# EAGLE design NICBP (EAGLE 8.1.0)
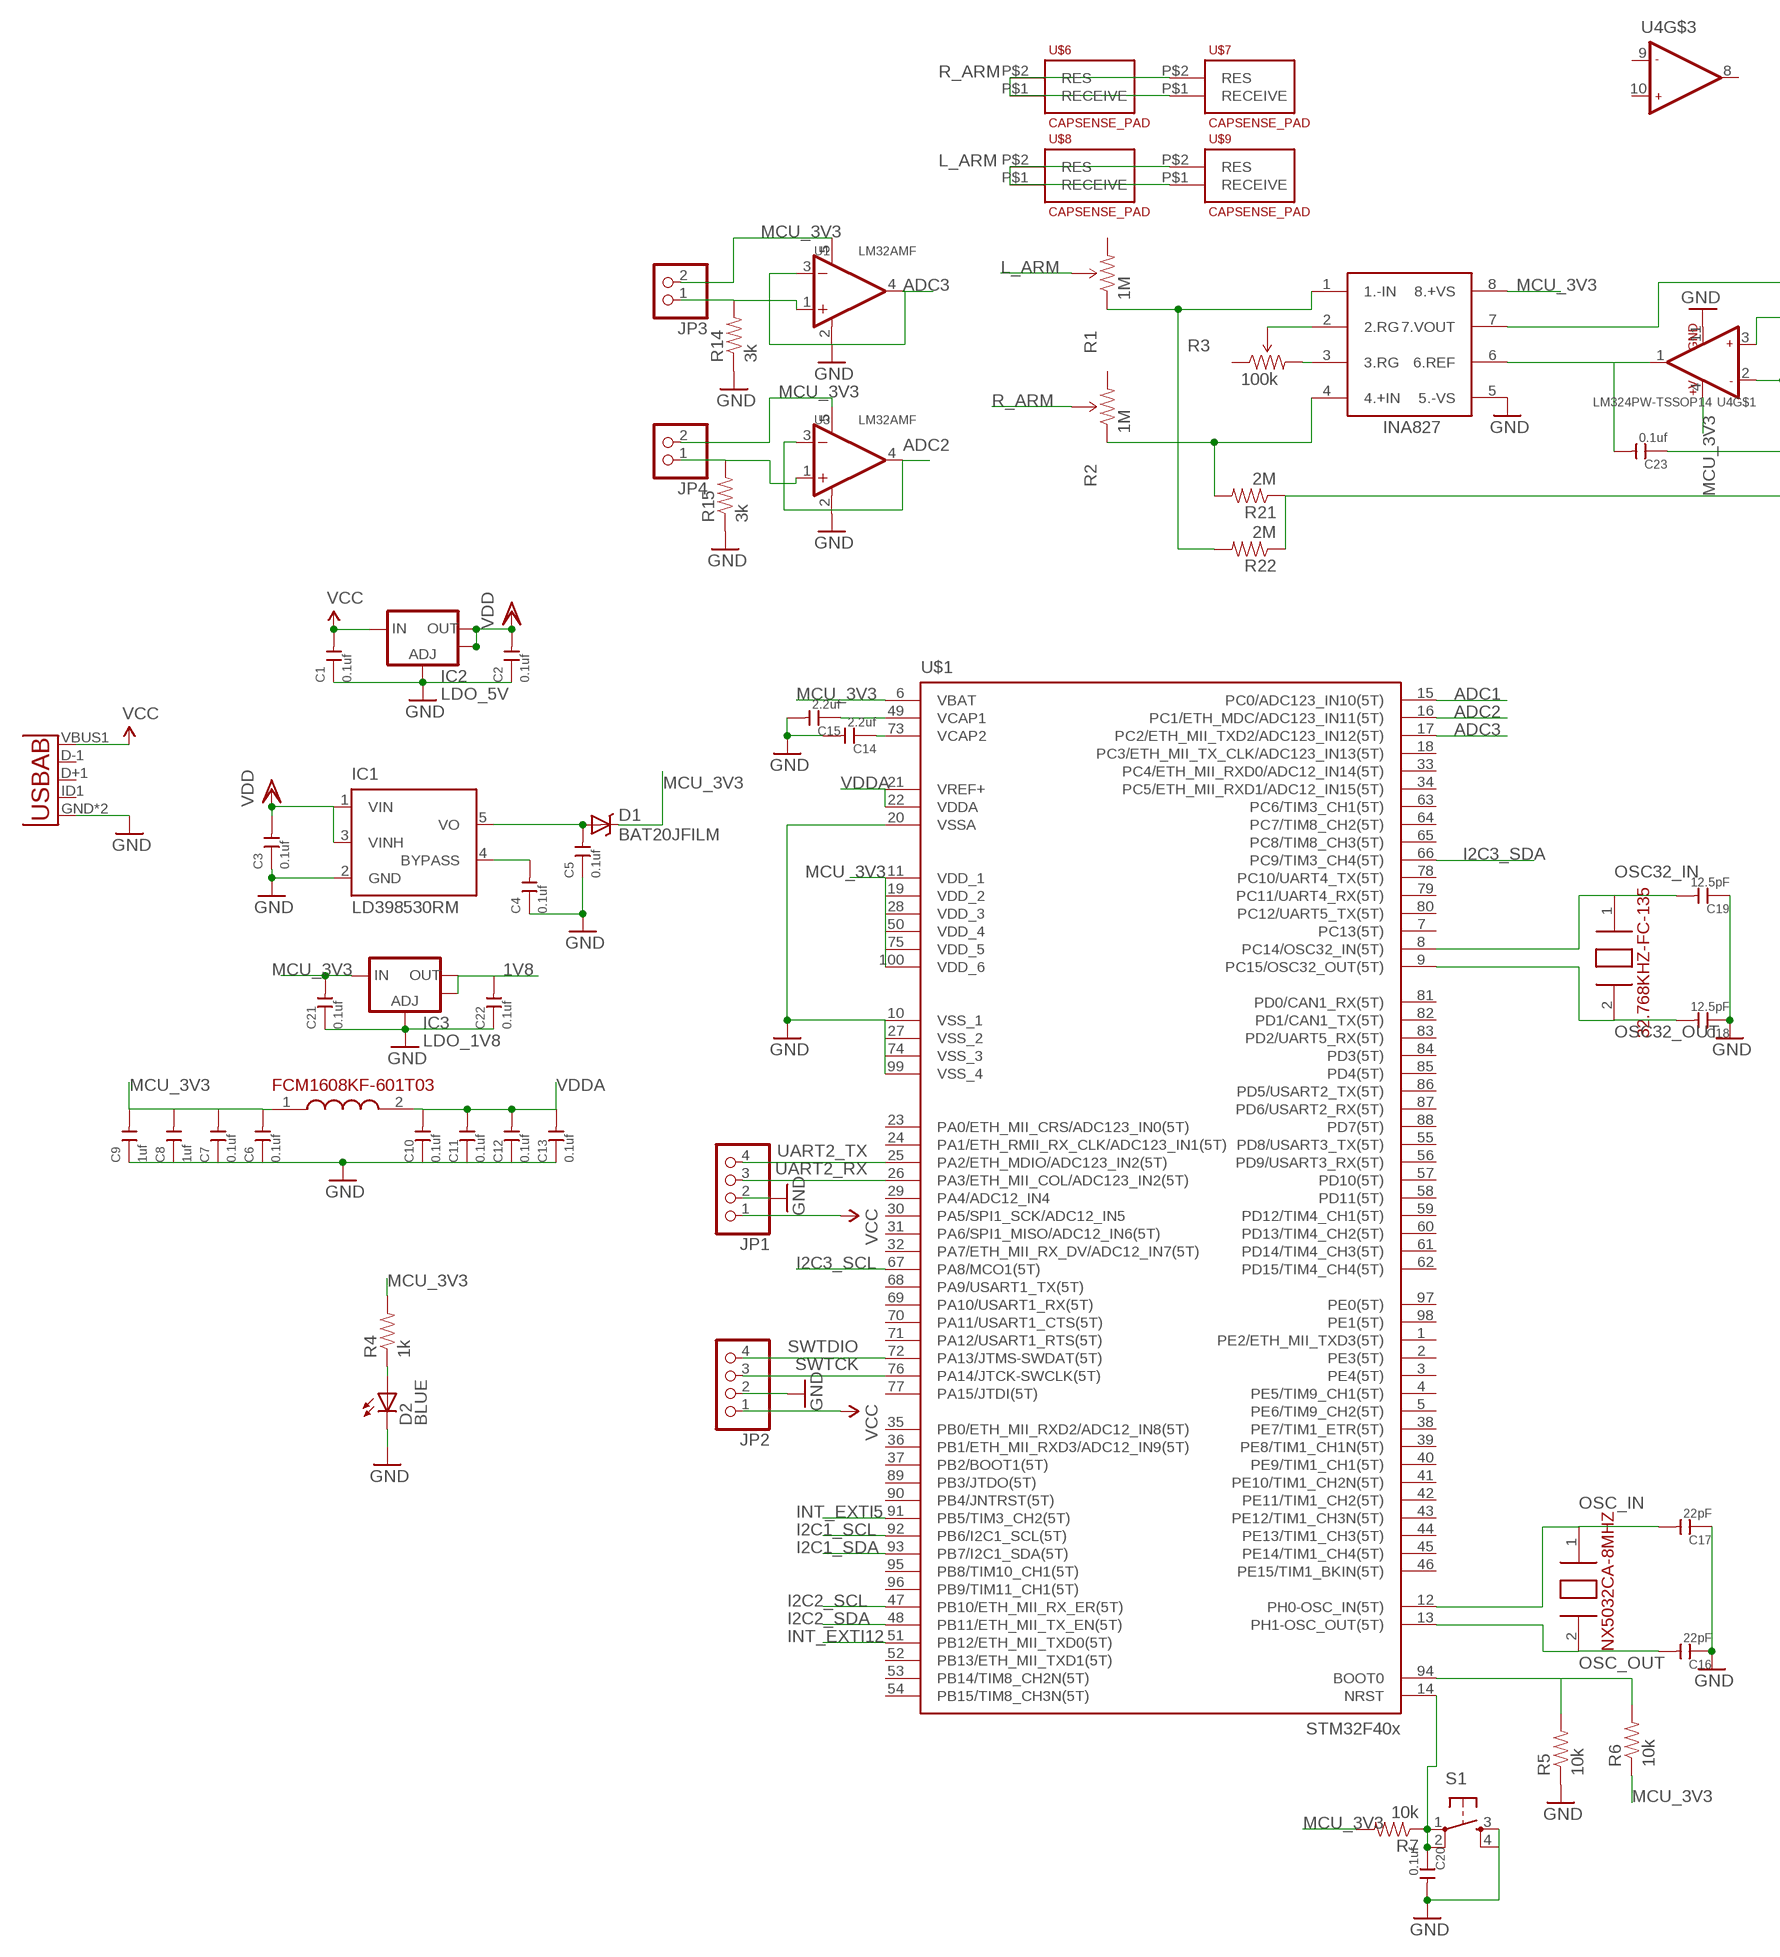
[diagram p0: schematic, sheet 1, part 1 of 2]
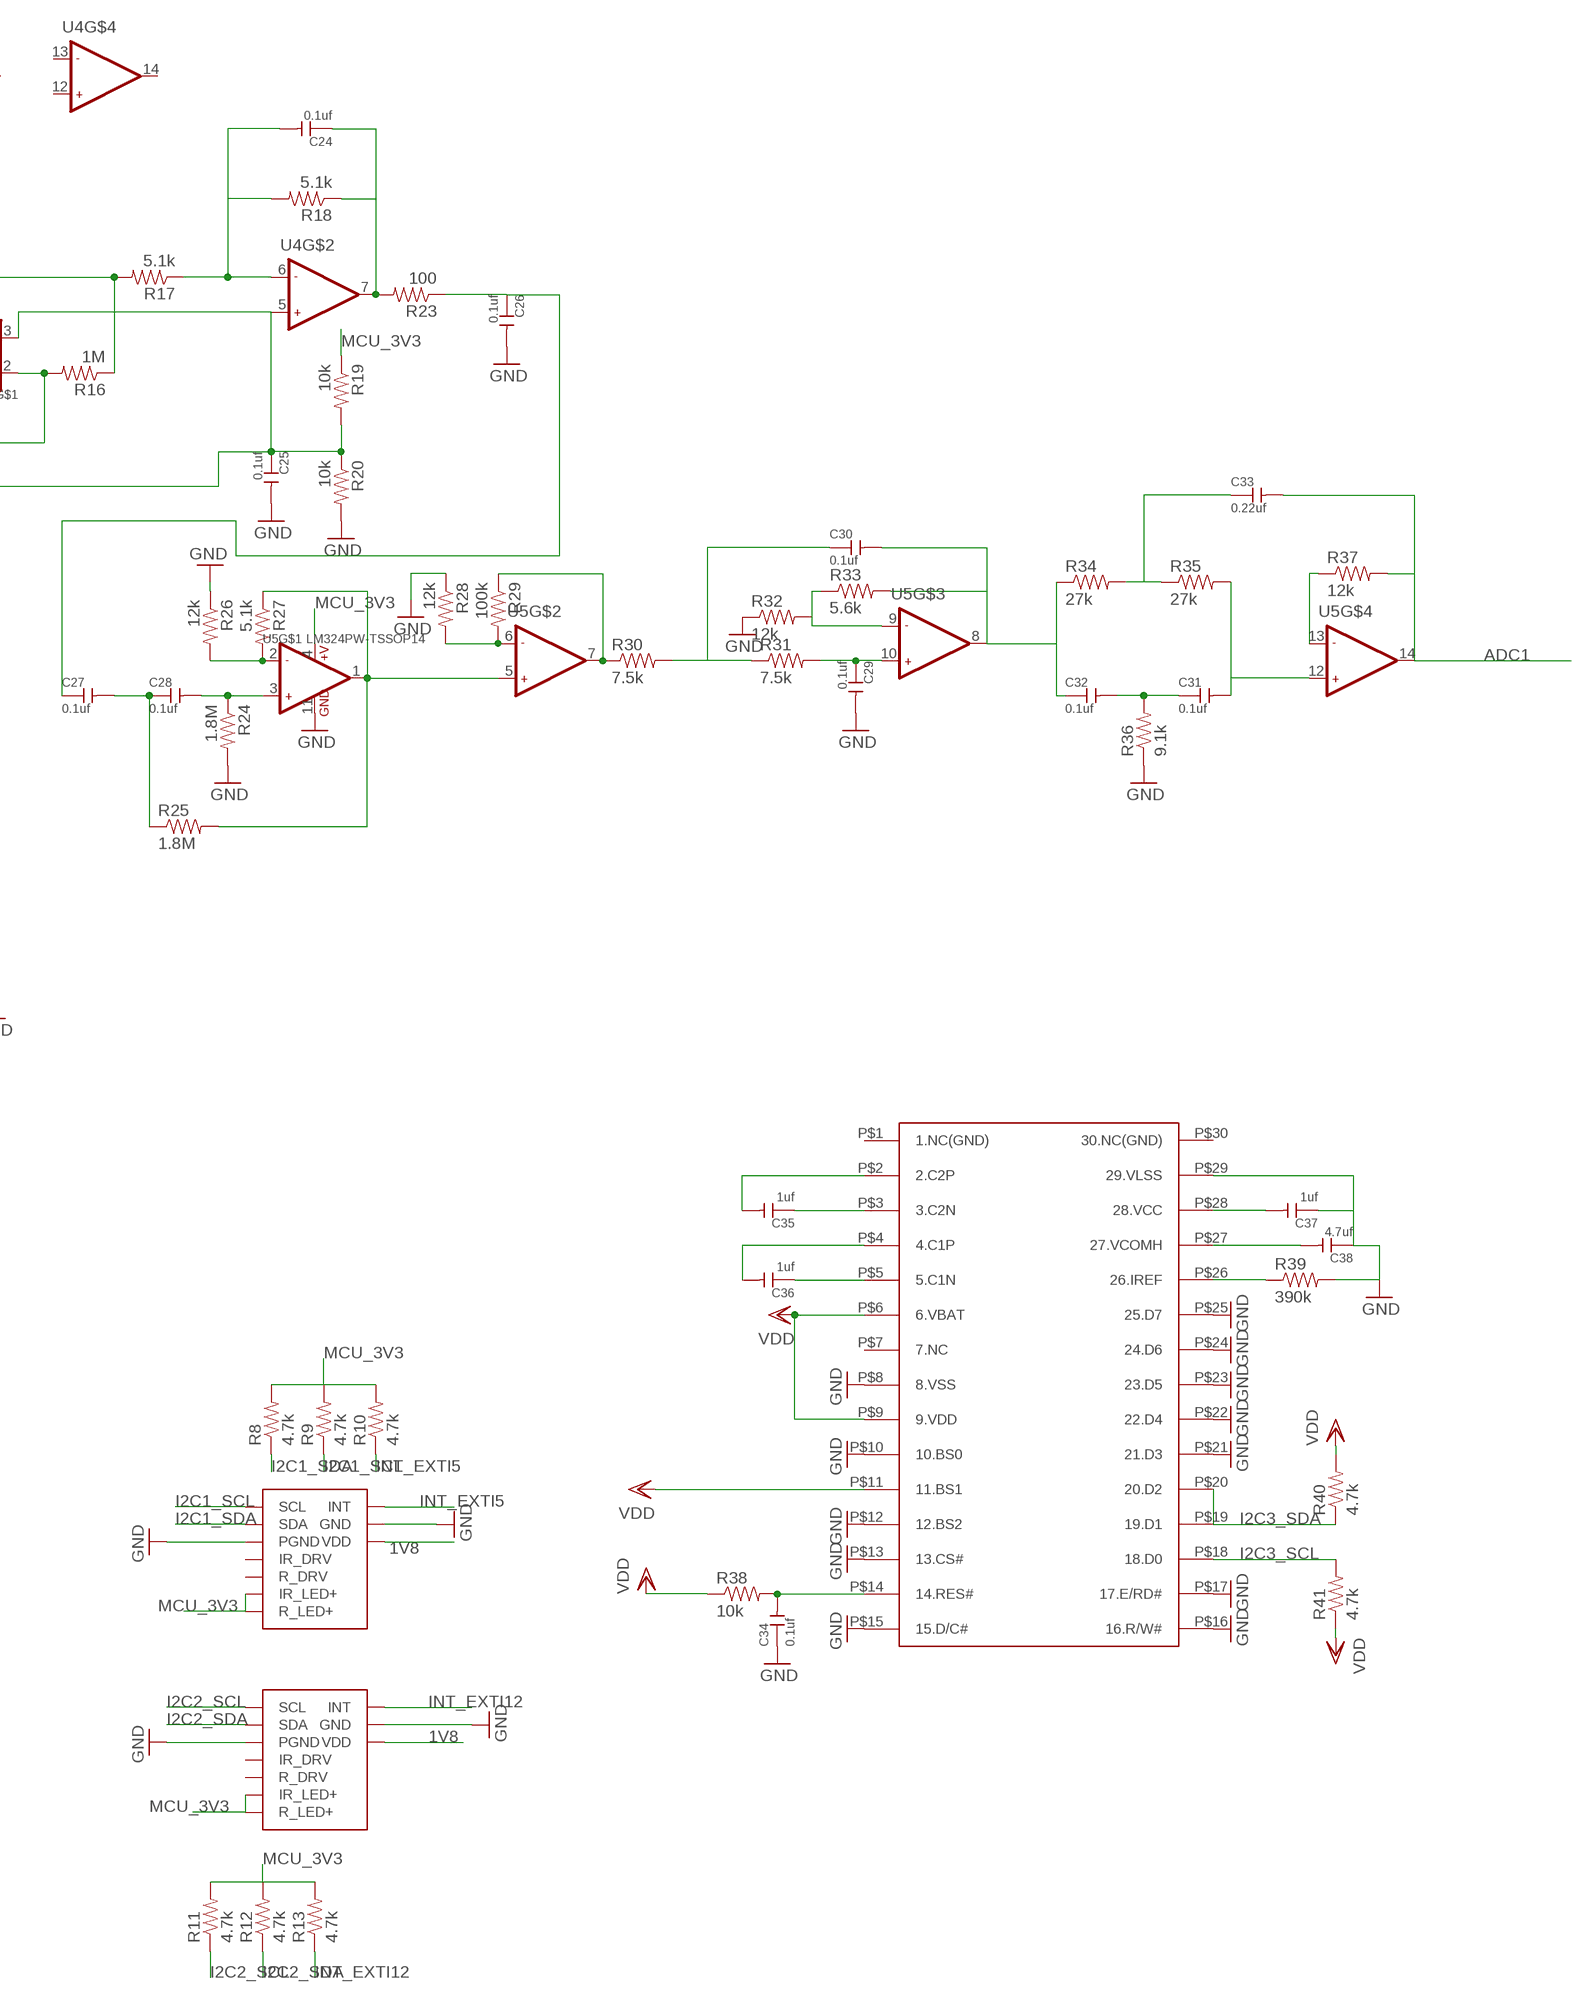
[diagram p1: schematic, sheet 1, part 2 of 2]

## Parts
C1  0.1uf  CERAMIC-4.7UF-10V-10%-X5R(0603)  [C0603]
C2  0.1uf  CERAMIC-4.7UF-10V-10%-X5R(0603)  [C0603]
C3  0.1uf  CERAMIC-4.7UF-10V-10%-X5R(0603)  [C0603]
C4  0.1uf  CERAMIC-4.7UF-10V-10%-X5R(0603)  [C0603]
C5  0.1uf  CERAMIC-4.7UF-10V-10%-X5R(0603)  [C0603]
C6  0.1uf  CERAMIC-4.7UF-10V-10%-X5R(0603)  [C0603]
C7  0.1uf  CERAMIC-4.7UF-10V-10%-X5R(0603)  [C0603]
C8  1uf  CERAMIC-4.7UF-10V-10%-X5R(0603)  [C0603]
C9  1uf  CERAMIC-4.7UF-10V-10%-X5R(0603)  [C0603]
C10  0.1uf  CERAMIC-4.7UF-10V-10%-X5R(0603)  [C0603]
C11  0.1uf  CERAMIC-4.7UF-10V-10%-X5R(0603)  [C0603]
C12  0.1uf  CERAMIC-4.7UF-10V-10%-X5R(0603)  [C0603]
C13  0.1uf  CERAMIC-4.7UF-10V-10%-X5R(0603)  [C0603]
C14  2.2uf  CERAMIC-4.7UF-10V-10%-X5R(0603)  [C0603]
C15  2.2uf  CERAMIC-4.7UF-10V-10%-X5R(0603)  [C0603]
C16  22pF  CERAMIC-4.7UF-10V-10%-X5R(0603)  [C0603]
C17  22pF  CERAMIC-4.7UF-10V-10%-X5R(0603)  [C0603]
C18  12.5pF  CERAMIC-4.7UF-10V-10%-X5R(0603)  [C0603]
C19  12.5pF  CERAMIC-4.7UF-10V-10%-X5R(0603)  [C0603]
C20  0.1uf  CERAMIC-4.7UF-10V-10%-X5R(0603)  [C0603]
C21  0.1uf  CERAMIC-4.7UF-10V-10%-X5R(0603)  [C0603]
C22  0.1uf  CERAMIC-4.7UF-10V-10%-X5R(0603)  [C0603]
C23  0.1uf  CERAMIC-4.7UF-10V-10%-X5R(0603)  [C0603]
C24  0.1uf  CERAMIC-4.7UF-10V-10%-X5R(0603)  [C0603]
C25  0.1uf  CERAMIC-4.7UF-10V-10%-X5R(0603)  [C0603]
C26  0.1uf  CERAMIC-4.7UF-10V-10%-X5R(0603)  [C0603]
C27  0.1uf  CERAMIC-4.7UF-10V-10%-X5R(0603)  [C0603]
C28  0.1uf  CERAMIC-4.7UF-10V-10%-X5R(0603)  [C0603]
C29  0.1uf  CERAMIC-4.7UF-10V-10%-X5R(0603)  [C0603]
C30  0.1uf  CERAMIC-4.7UF-10V-10%-X5R(0603)  [C0603]
C31  0.1uf  CERAMIC-4.7UF-10V-10%-X5R(0603)  [C0603]
C32  0.1uf  CERAMIC-4.7UF-10V-10%-X5R(0603)  [C0603]
C33  0.22uf  CERAMIC-4.7UF-10V-10%-X5R(0603)  [C0603]
C34  0.1uf  CERAMIC-4.7UF-10V-10%-X5R(0603)  [C0603]
C35  1uf  CERAMIC-4.7UF-10V-10%-X5R(0603)  [C0603]
C36  1uf  CERAMIC-4.7UF-10V-10%-X5R(0603)  [C0603]
C37  1uf  CERAMIC-4.7UF-10V-10%-X5R(0603)  [C0603]
C38  4.7uf  CERAMIC-4.7UF-10V-10%-X5R(0603)  [C0603]
D1  BAT20JFILM  [SOD-323]
D2  BLUE  LED-BLUE0603  [LED-0603]
IC1  LD398530RM  [SOT23-5L]
IC2  LDO_5V  V_REG_LM1117SOT223  [SOT223]
IC3  LDO_1V8  V_REG_LM1117SOT223  [SOT223]
JP1  PINHD-1X4  [1X04]
JP2  PINHD-1X4  [1X04]
JP3  PINHD-1X2  [1X02]
JP4  PINHD-1X2  [1X02]
R1  1M  TRIMPOT-2  [TRIMPOT_TC33]
R2  1M  TRIMPOT-2  [TRIMPOT_TC33]
R3  100k  TRIMPOT-2  [TRIMPOT_TC33]
R4  1k  0OHM1/10W5%(0603)  [0603]
R5  10k  0OHM1/10W5%(0603)  [0603]
R6  10k  0OHM1/10W5%(0603)  [0603]
R7  10k  0OHM1/10W5%(0603)  [0603]
R8  4.7k  0OHM1/10W5%(0603)  [0603]
R9  4.7k  0OHM1/10W5%(0603)  [0603]
R10  4.7k  0OHM1/10W5%(0603)  [0603]
R11  4.7k  0OHM1/10W5%(0603)  [0603]
R12  4.7k  0OHM1/10W5%(0603)  [0603]
R13  4.7k  0OHM1/10W5%(0603)  [0603]
R14  3k  0OHM1/10W5%(0603)  [0603]
R15  3k  0OHM1/10W5%(0603)  [0603]
R16  1M  0OHM1/10W5%(0603)  [0603]
R17  5.1k  0OHM1/10W5%(0603)  [0603]
R18  5.1k  0OHM1/10W5%(0603)  [0603]
R19  10k  0OHM1/10W5%(0603)  [0603]
R20  10k  0OHM1/10W5%(0603)  [0603]
R21  2M  0OHM1/10W5%(0603)  [0603]
R22  2M  0OHM1/10W5%(0603)  [0603]
R23  100  0OHM1/10W5%(0603)  [0603]
R24  1.8M  0OHM1/10W5%(0603)  [0603]
R25  1.8M  0OHM1/10W5%(0603)  [0603]
R26  12k  0OHM1/10W5%(0603)  [0603]
R27  5.1k  0OHM1/10W5%(0603)  [0603]
R28  12k  0OHM1/10W5%(0603)  [0603]
R29  100k  0OHM1/10W5%(0603)  [0603]
R30  7.5k  0OHM1/10W5%(0603)  [0603]
R31  7.5k  0OHM1/10W5%(0603)  [0603]
R32  12k  0OHM1/10W5%(0603)  [0603]
R33  5.6k  0OHM1/10W5%(0603)  [0603]
R34  27k  0OHM1/10W5%(0603)  [0603]
R35  27k  0OHM1/10W5%(0603)  [0603]
R36  9.1k  0OHM1/10W5%(0603)  [0603]
R37  12k  0OHM1/10W5%(0603)  [0603]
R38  10k  0OHM1/10W5%(0603)  [0603]
R39  390k  0OHM1/10W5%(0603)  [0603]
R40  4.7k  0OHM1/10W5%(0603)  [0603]
R41  4.7k  0OHM1/10W5%(0603)  [0603]
S1  TAC_SWITCHSMD  [TACTILE_SWITCH_SMD]
U1  LM32AMF  AMPLIFIER-LM321MF(SOT23-5)  [SOT-23-5]
U2  USB""  [USB-MICRO-SMD]
U3  LM32AMF  AMPLIFIER-LM321MF(SOT23-5)  [SOT-23-5]
U4  LM324PW-TSSOP14  AMPLIFIER-LM324PW(TSSOP14)  [TSSOP14-0.65-5X4.4MM]
U5  LM324PW-TSSOP14  AMPLIFIER-LM324PW(TSSOP14)  [TSSOP14-0.65-5X4.4MM]
U$1  STM32F407V  [TQFP100]
U$2  NX5032CA-8MHZ  [NX5032CA-8MHZ]
U$3  FCM1608KF-601T03  [FCM1608KF-601T03]
U$4  32.768KHZ-FC-135  [32.768KHZ-FC-135]
U$5  INA827  [INA827]
U$6  CAPSENSE_PAD  [CAPSENSE_PAD]
U$7  CAPSENSE_PAD  [CAPSENSE_PAD]
U$8  CAPSENSE_PAD  [CAPSENSE_PAD]
U$9  CAPSENSE_PAD  [CAPSENSE_PAD]
U$10  MAX30100  [MAX30100]
U$11  MAX30100  [MAX30100]
U$12  ER-OLED0.96  [ER-OLED0.96]

## Nets
1V8: C22.2 IC3.2(OUT) IC3.4(OUT) U$10.11(VDD) U$11.11(VDD)
ADC1: C33.2 R37.2 U5.14(OUT2) U$1.15(PC0/ADC123_IN10(5T))
ADC2: U3.3(IN-) U3.4(OUT) U$1.16(PC1/ETH_MDC/ADC123_IN11(5T))
ADC3: U1.3(IN-) U1.4(OUT) U$1.17(PC2/ETH_MII_TXD2/ADC123_IN12(5T))
GND: C1.1 C2.1 C3.1 C4.1 C5.1 C6.1 C7.1 C8.1 C9.1 C10.1 C11.1 C12.1 C13.1 C14.2 C15.2 C16.1 C17.1 C18.1 C19.1 C20.2 C21.1 C22.1 C25.2 C26.2 C29.2 C34.1 C37.1 C38.1 D2.C IC1.2(GND) IC2.1(ADJ) IC3.1(ADJ) JP1.2 JP2.2 R5.1 R14.1 R15.1 R20.2 R24.2 R26.1 R28.1 R32.1 R36.1 R39.2 S1.3 S1.4 U1.2(V-) U2.GND U2.GND1(GND) U3.2(V-) U4.11(GND) U5.11(GND) U$1.10(VSS_1) U$1.20(VSSA) U$1.27(VSS_2) U$1.74(VSS_3) U$1.99(VSS_4) U$5.5(5.-VS) U$10.4(PGND) U$10.12(GND) U$11.4(PGND) U$11.12(GND) U$12.P$8(8.VSS) U$12.P$10(10.BS0) U$12.P$12(12.BS2) U$12.P$13(13.CS#) U$12.P$15(15.D/C#) U$12.P$16(16.R/W#) U$12.P$17(17.E/RD#) U$12.P$21(21.D3) U$12.P$22(22.D4) U$12.P$23(23.D5) U$12.P$24(24.D6) U$12.P$25(25.D7) U$12.P$29(29.VLSS)
I2C1_SCL: R9.1 U$1.92(PB6/I2C1_SCL(5T)) U$10.2(SCL)
I2C1_SDA: R8.1 U$1.93(PB7/I2C1_SDA(5T)) U$10.3(SDA)
I2C2_SCL: R11.1 U$1.47(PB10/ETH_MII_RX_ER(5T)) U$11.2(SCL)
I2C2_SDA: R12.1 U$1.48(PB11/ETH_MII_TX_EN(5T)) U$11.3(SDA)
I2C3_SCL: R41.2 U$1.67(PA8/MCO1(5T)) U$12.P$18(18.D0)
I2C3_SDA: R40.1 U$1.66(PC9/TIM3_CH4(5T)) U$12.P$19(19.D1) U$12.P$20(20.D2)
INT_EXTI5: R10.1 U$1.91(PB5/TIM3_CH2(5T)) U$10.13(INT)
INT_EXTI12: R13.1 U$1.51(PB12/ETH_MII_TXD0(5T)) U$11.13(INT)
L_ARM: R1.2(WIPER) U$8.P$1(RECEIVE) U$8.P$2(RES) U$9.P$1(RECEIVE) U$9.P$2(RES)
MCU_3V3: C6.2 C7.2 C8.2 C9.2 C21.2 D1.1(C) IC3.3(IN) JP3.2 JP4.2 R4.2 R6.1 R7.2 R8.2 R9.2 R10.2 R11.2 R12.2 R13.2 R19.1 U1.5(V+) U3.5(V+) U4.4(+V) U5.4(+V) U$1.6(VBAT) U$1.11(VDD_1) U$1.19(VDD_2) U$1.28(VDD_3) U$1.50(VDD_4) U$1.75(VDD_5) U$1.100(VDD_6) U$3.1(1.IN) U$5.8(8.+VS) U$10.9(R_LED+) U$10.10(IR_LED+) U$11.9(R_LED+) U$11.10(IR_LED+)
N$1: D2.A R4.1
N$2: C15.1 U$1.49(VCAP1)
N$3: C14.1 U$1.73(VCAP2)
N$4: R5.2 R6.2 U$1.94(BOOT0)
N$5: C20.1 R7.1 S1.1 S1.2 U$1.14(NRST)
N$6: C4.2 IC1.4(BYPASS)
N$7: C5.2 D1.2(A) IC1.5(VO)
N$8: R3.3(CW) U$5.3(3.RG)
N$9: JP4.1 R15.2 U3.1(IN+)
N$10: JP3.1 R14.2 U1.1(IN+)
N$11: R3.2(WIPER) U$5.2(2.RG)
N$12: C23.2 U4.1(OUT1) U$5.6(6.REF)
N$13: R1.1(CCW) R22.2 U$5.1(1.-IN)
N$14: R2.1(CCW) R21.2 U$5.4(4.+IN)
N$15: C23.1 R16.2 U4.2(-IN1)
N$16: R16.1 R17.2 U$5.7(7.VOUT)
N$17: C24.2 R17.1 R18.2 U4.6(-IN2)
N$18: C25.1 R19.2 R20.1 R21.1 R22.1 U4.3(+IN1) U4.5(+IN2)
N$19: C24.1 R18.1 R23.2 U4.7(OUT2)
N$20: C26.1 C27.1 R23.1
N$21: R26.2 R27.2 U5.2(-IN1)
N$22: R25.2 R27.1 U5.1(OUT1) U5.5(+IN2)
N$23: C28.2 R24.1 U5.3(+IN1)
N$24: C27.2 C28.1 R25.1
N$25: R28.2 R29.2 U5.6(-IN2)
N$26: R29.1 R30.1 U5.7(OUT2)
N$27: C30.1 R30.2 R31.1
N$28: C29.1 R31.2 U5.10(+IN2)
N$29: C30.2 C32.1 R33.2 R34.1 U5.8(OUT2)
N$30: R32.2 R33.1 U5.9(-IN2)
N$31: C33.1 R34.2 R35.1
N$32: C31.1 C32.2 R36.2
N$33: C34.2 R38.2 U$12.P$14(14.RES#)
N$34: C31.2 R35.2 U5.12(+IN2)
N$35: R37.1 U5.13(-IN2)
N$38: C35.1 U$12.P$3(3.C2N)
N$39: C36.1 U$12.P$5(5.C1N)
N$40: C35.2 U$12.P$2(2.C2P)
N$41: C36.2 U$12.P$4(4.C1P)
N$42: R39.1 U$12.P$26(26.IREF)
N$43: C38.2 U$12.P$27(27.VCOMH)
N$44: C37.2 U$12.P$28(28.VCC)
OSC32_IN: C19.2 U$1.8(PC14/OSC32_IN(5T)) U$4.1(1.XIN)
OSC32_OUT: C18.2 U$1.9(PC15/OSC32_OUT(5T)) U$4.2(2.XIN)
OSC_IN: C17.2 U$1.12(PH0-OSC_IN(5T)) U$2.1(1.XIN)
OSC_OUT: C16.2 U$1.13(PH1-OSC_OUT(5T)) U$2.2(2.XOUT)
R_ARM: R2.2(WIPER) U$6.P$1(RECEIVE) U$6.P$2(RES) U$7.P$1(RECEIVE) U$7.P$2(RES)
SWTCK: JP2.3 U$1.76(PA14/JTCK-SWCLK(5T))
SWTDIO: JP2.4 U$1.72(PA13/JTMS-SWDAT(5T))
UART2_RX: JP1.3 U$1.26(PA3/ETH_MII_COL/ADC123_IN2(5T))
UART2_TX: JP1.4 U$1.25(PA2/ETH_MDIO/ADC123_IN2(5T))
VCC: C1.2 IC2.3(IN) JP1.1 JP2.1 U2.VBUS1(VBUS)
VDD: C2.2 C3.2 IC1.1(VIN) IC1.3(VINH) IC2.2(OUT) IC2.4(OUT) R38.1 R40.2 R41.1 U$12.P$6(6.VBAT) U$12.P$9(9.VDD) U$12.P$11(11.BS1)
VDDA: C10.2 C11.2 C12.2 C13.2 U$1.21(VREF+) U$1.22(VDDA) U$3.2(2.OUT)
Unconnected: R1.3(CW) R2.3(CW) R3.1(CCW) U2.D+1(D+) U2.D-1(D-) U2.ID1(USBID) U4.8(OUT2) U4.9(-IN2) U4.10(+IN2) U4.12(+IN2) U4.13(-IN2) U4.14(OUT2) U$1.1(PE2/ETH_MII_TXD3(5T)) U$1.2(PE3(5T)) U$1.3(PE4(5T)) U$1.4(PE5/TIM9_CH1(5T)) U$1.5(PE6/TIM9_CH2(5T)) U$1.7(PC13(5T)) U$1.18(PC3/ETH_MII_TX_CLK/ADC123_IN13(5T)) U$1.23(PA0/ETH_MII_CRS/ADC123_IN0(5T)) U$1.24(PA1/ETH_RMII_RX_CLK/ADC123_IN1(5T)) U$1.29(PA4/ADC12_IN4) U$1.30(PA5/SPI1_SCK/ADC12_IN5) U$1.31(PA6/SPI1_MISO/ADC12_IN6(5T)) U$1.32(PA7/ETH_MII_RX_DV/ADC12_IN7(5T)) U$1.33(PC4/ETH_MII_RXD0/ADC12_IN14(5T)) U$1.34(PC5/ETH_MII_RXD1/ADC12_IN15(5T)) U$1.35(PB0/ETH_MII_RXD2/ADC12_IN8(5T)) U$1.36(PB1/ETH_MII_RXD3/ADC12_IN9(5T)) U$1.37(PB2/BOOT1(5T)) U$1.38(PE7/TIM1_ETR(5T)) U$1.39(PE8/TIM1_CH1N(5T)) U$1.40(PE9/TIM1_CH1(5T)) U$1.41(PE10/TIM1_CH2N(5T)) U$1.42(PE11/TIM1_CH2(5T)) U$1.43(PE12/TIM1_CH3N(5T)) U$1.44(PE13/TIM1_CH3(5T)) U$1.45(PE14/TIM1_CH4(5T)) U$1.46(PE15/TIM1_BKIN(5T)) U$1.52(PB13/ETH_MII_TXD1(5T)) U$1.53(PB14/TIM8_CH2N(5T)) U$1.54(PB15/TIM8_CH3N(5T)) U$1.55(PD8/USART3_TX(5T)) U$1.56(PD9/USART3_RX(5T)) U$1.57(PD10(5T)) U$1.58(PD11(5T)) U$1.59(PD12/TIM4_CH1(5T)) U$1.60(PD13/TIM4_CH2(5T)) U$1.61(PD14/TIM4_CH3(5T)) U$1.62(PD15/TIM4_CH4(5T)) U$1.63(PC6/TIM3_CH1(5T)) U$1.64(PC7/TIM8_CH2(5T)) U$1.65(PC8/TIM8_CH3(5T)) U$1.68(PA9/USART1_TX(5T)) U$1.69(PA10/USART1_RX(5T)) U$1.70(PA11/USART1_CTS(5T)) U$1.71(PA12/USART1_RTS(5T)) U$1.77(PA15/JTDI(5T)) U$1.78(PC10/UART4_TX(5T)) U$1.79(PC11/UART4_RX(5T)) U$1.80(PC12/UART5_TX(5T)) U$1.81(PD0/CAN1_RX(5T)) U$1.82(PD1/CAN1_TX(5T)) U$1.83(PD2/UART5_RX(5T)) U$1.84(PD3(5T)) U$1.85(PD4(5T)) U$1.86(PD5/USART2_TX(5T)) U$1.87(PD6/USART2_RX(5T)) U$1.88(PD7(5T)) U$1.89(PB3/JTDO(5T)) U$1.90(PB4/JNTRST(5T)) U$1.95(PB8/TIM10_CH1(5T)) U$1.96(PB9/TIM11_CH1(5T)) U$1.97(PE0(5T)) U$1.98(PE1(5T)) U$10.5(IR_DRV) U$10.6(R_DRV) U$11.5(IR_DRV) U$11.6(R_DRV) U$12.P$1(1.NC(GND)) U$12.P$7(7.NC) U$12.P$30(30.NC(GND))

## Library data of the parts
C1-C37 = Seeed-OPL-Capacitor:CERAMIC-4.7UF-10V-10%-X5R(0603): 302010111; MPN: CC0603KRX5R6BB475; VALUE: 4.7uf
C38 = Seeed-OPL-Capacitor:CERAMIC-4.7UF-10V-10%-X5R(0603): 302010111; MPN: CC0603KRX5R6BB475
D1 = SparkFun-DiscreteSemi:BAT20JFILM: 23V, 1A Schottky diode, SOD-323 package; PROD_ID: DIO-11623
D2 = SparkFun-LED:LED-BLUE: Blue LEDs for production use Various blue LEDs stocked by SparkFun production 0603 - DIO-08575 Rebel - DIO-09553 1206 - DIO-09911; PROD_ID: DIO-08575
IC1 = st-microelectronics:LD3985: Ultra low drop and low noise BiCMOS voltage regulators Source: www.st.com LD3985.pdf
IC2 IC3 = SparkFun-PowerIC:V_REG_LM1117: Voltage Regulator LM1117 Standard adjustable voltage regulator but in SMD form. Spark Fun Electronics SKU : COM-00595
JP1 JP2 = pinhead:PINHD-1X4: PIN HEADER
JP3 JP4 = pinhead:PINHD-1X2: PIN HEADER
R1-R3 = SparkFun-Electromechanical:TRIMPOT: Various small potentiometers for "set-and-forget" applications
R4-R41 = SparkFun-Resistors:0OHM1/10W5%(0603): RES-08609; PROD_ID: RES-08609; VALUE: 0
S1 = SparkFun-Electromechanical:TAC_SWITCH: Momentary Switch Button commonly used for reset or general input. Spark Fun Electronics SKU : COM-00097 SMT- SWCH-08247; PROD_ID: SWCH-08247
U1 U3 = Seeed-OPL-ic:AMPLIFIER-LM321MF(SOT23-5): 310020001; MPN: LM321MF
U2 = MicroUSB Long GND:USB: This is a USB AB connector that is compatible with USB OTG. i.e. this connector can serve as a host or device
U4 U5 = Seeed-OPL-ic:AMPLIFIER-LM324PW(TSSOP14): 310020008; MPN: LM324PW
U$1 = stm32f4:STM32F407V: STM32F407 100 pin LQFP reviewed: YES tested: YES
U$2 = NX5032CA-8MHZ:NX5032CA-8MHZ
U$3 = FCM1608KF-601T03:FCM1608KF-601T03
U$4 = 32.768KHZ-FC-135:32.768KHZ-FC-135
U$5 = INA827:INA827
U$6-U$9 = SparkFun-Electromechanical:CAPSENSE_PAD: Generic copper pad for a capacitive touch sensor.
U$10 U$11 = MAX30100:MAX30100
U$12 = ER-OLED0.96:ER-OLED0.96

## Board
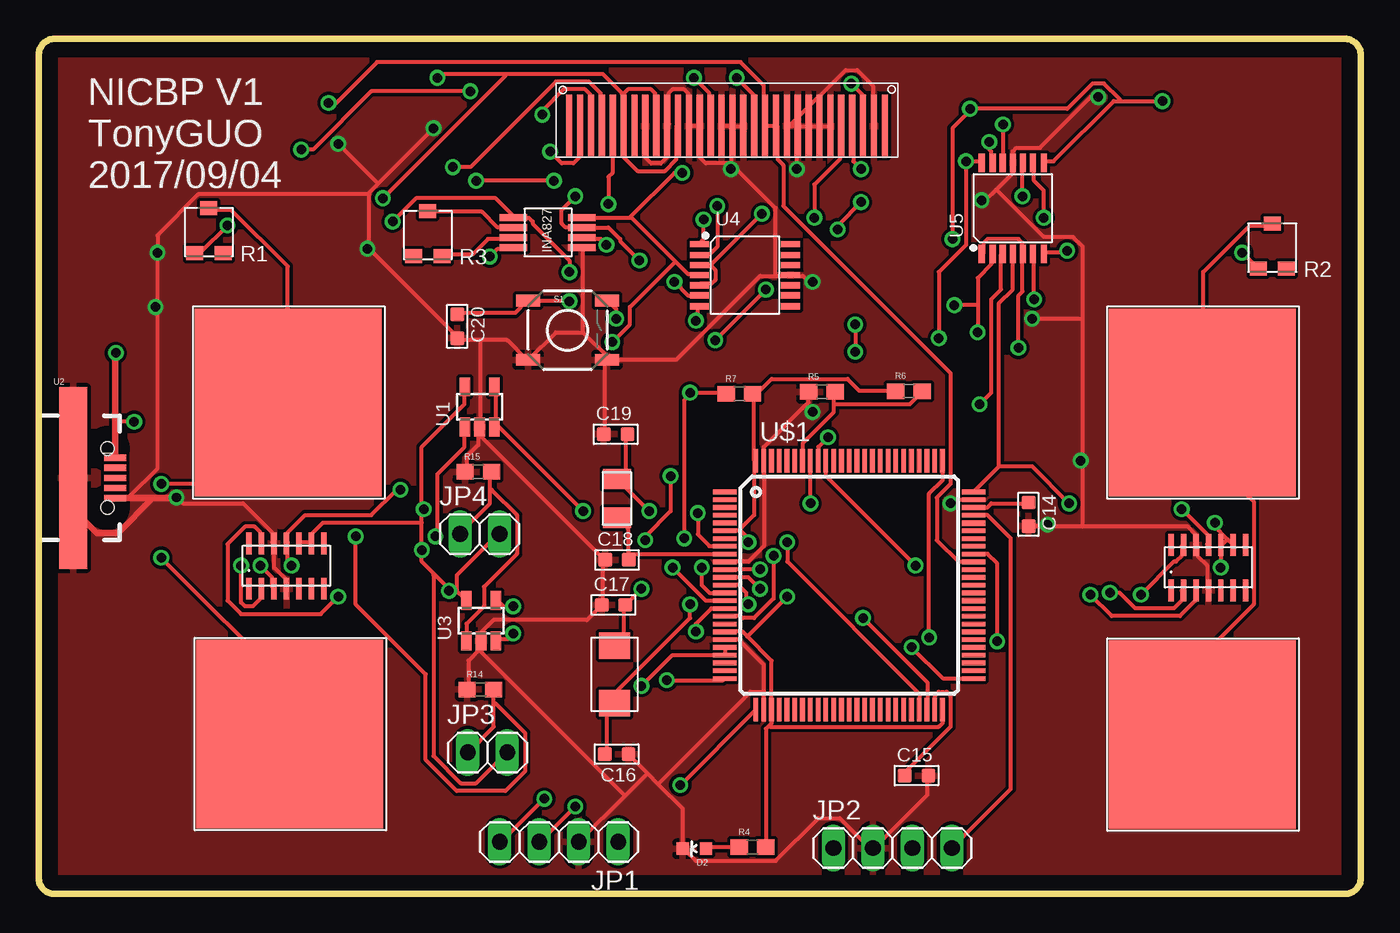
[diagram p2: board, top side]
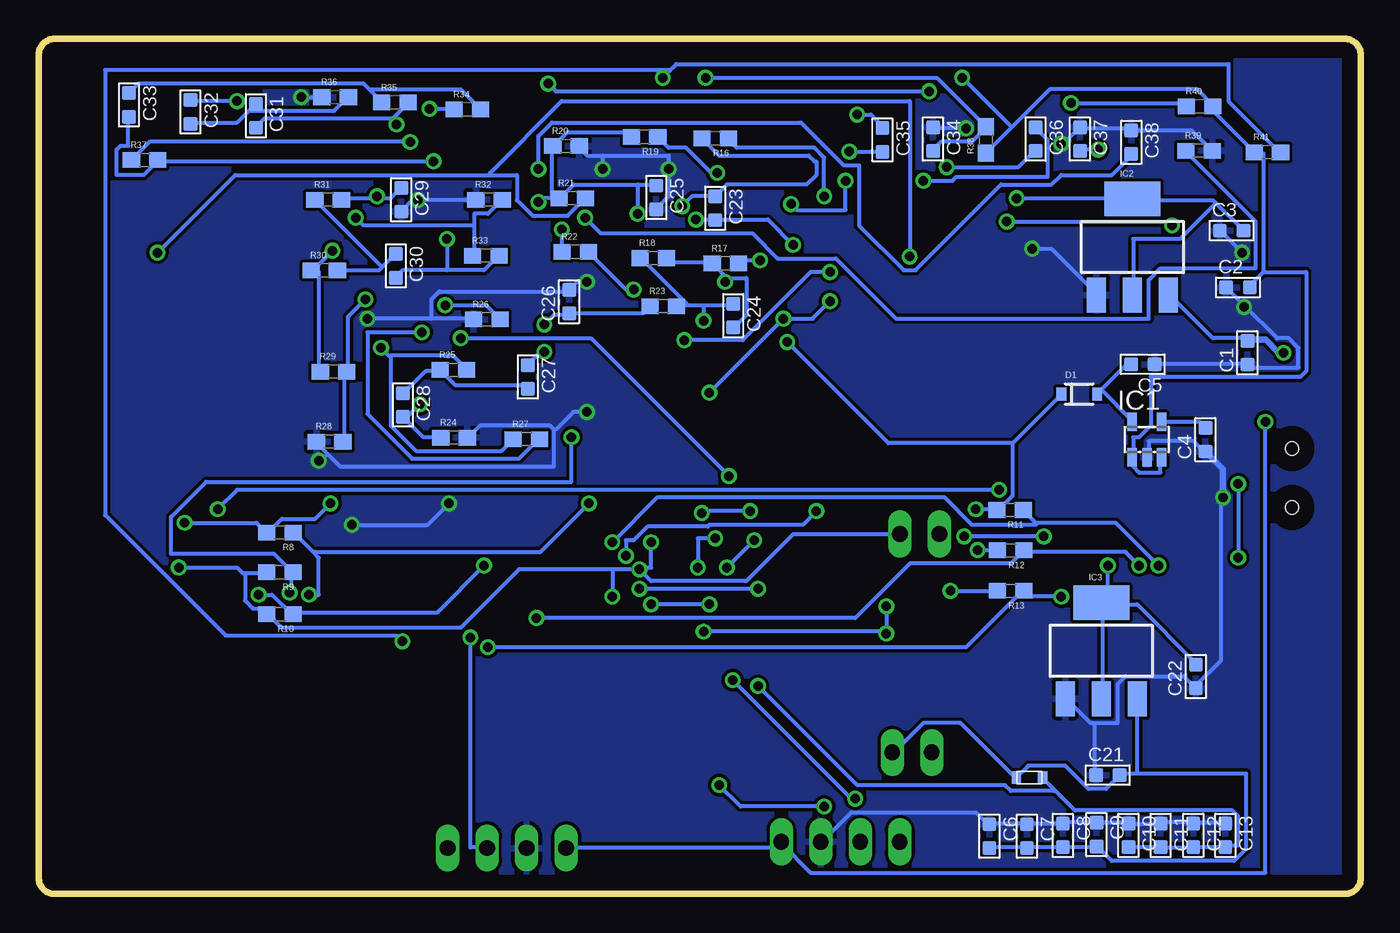
[diagram p3: board, bottom side, seen from below]

Size 85 x 55 mm. Coordinates in mm from the lower left corner, seen from the top.
Outline: 85,1 85,54 arc90 84,55 1,55 arc90 0,54 0,1 arc90 1,0 84,0 arc90 85,1
Copper layers (1*16): Top 0.035mm / dielectric 1.5mm / Bottom 0.035mm
Design rules "default": minimum track width 10mil, minimum drill 24mil, track to track 8mil, track to pad 8mil, pad to pad 8mil, via to via 8mil, smd to smd 8mil, copper to edge 40mil, drill to drill 8mil, minimum pad ring 10mil, minimum via ring 8mil, stop-mask expansion 4mil, vias tented up to drill 0mil, thermal gap 10mil

### Footprints (pad centres in the part's own frame; a part is rotated, then mirrored left to right if it is on the bottom)
C0603 = smd 0.889 x 0.889: 1 0,0.762; 2 0,-0.762
SOD-323 = smd 0.63 x 0.83: 1 -1.15,0; 2 1.15,0
LED-0603 = smd 0.8 x 0.8: A 0,-0.75; C 0,0.75
SOT23-5L = smd 0.6 x 1.2: 1 -0.95,-1.15; 2 0,-1.15; 3 0.95,-1.15; 4 0.95,1.15; 5 -0.95,1.15
SOT223 = smd 1.219 x 2.235: 1 -2.311,-3.099; 2 0,-3.099; 3 2.311,-3.099 | smd 3.6 x 2.2: 4 0,3.099
1X04 = drill 1.016 long: 1 -3.81,0; 2 -1.27,0; 3 1.27,0; 4 3.81,0
1X02 = drill 1.016 long: 1 -1.27,0; 2 1.27,0
TRIMPOT_TC33 = smd 1.1 x 0.9: 1 -0.91,-1.45; 2 0,1.45; 3 0.91,-1.45
0603 = smd 1.1 x 1: 1 -0.85,0; 2 0.85,0
TACTILE_SWITCH_SMD = smd 1.524 x 0.762: 1 -2.54,1.905; 2 2.54,1.905; 3 -2.54,-1.905; 4 2.54,-1.905
SOT-23-5 = smd 0.69 x 1.2: 1 -0.95,-1.3; 2 0,-1.3; 3 0.95,-1.3; 4 0.95,1.3; 5 -0.95,1.3
USB-MICRO-SMD = smd 1.4 x 0.4: D+1 2.7,0; D-1 2.7,0.65; GND1 2.7,-1.3; ID1 2.7,-0.65; VBUS1 2.7,1.3 | smd 1.778 x 11.684: GND 0,0 | hole 0.85: 2.2,1.9; 2.2,-1.9
TSSOP14-0.65-5X4.4MM = smd 0.4 x 1.2: 1 -2,-2.925; 2 -1.3,-2.925; 3 -0.65,-2.925; 4 0,-2.925; 5 0.65,-2.925; 6 1.3,-2.925; 7 2,-2.925; 8 2,2.925; 9 1.3,2.925; 10 0.65,2.925; 11 0,2.925; 12 -0.65,2.925; 13 -1.3,2.925; 14 -2,2.925
TQFP100 = smd 1.5 x 0.3: 1 -8,6; 2 -8,5.5; 3 -8,5; 4 -8,4.5; 5 -8,4; 6 -8,3.5; 7 -8,3; 8 -8,2.5; 9 -8,2; 10 -8,1.5; 11 -8,1; 12 -8,0.5; 13 -8,0; 14 -8,-0.5; 15 -8,-1; 16 -8,-1.5; 17 -8,-2; 18 -8,-2.5; 19 -8,-3; 20 -8,-3.5; 21 -8,-4; 22 -8,-4.5; 23 -8,-5; 24 -8,-5.5; 25 -8,-6; 51 8,-6; 52 8,-5.5; 53 8,-5; 54 8,-4.5; 55 8,-4; 56 8,-3.5; 57 8,-3; 58 8,-2.5; 59 8,-2; 60 8,-1.5; 62 8,-0.5; 63 8,0; 64 8,0.5; 65 8,1; 66 8,1.5; 67 8,2; 68 8,2.5; 69 8,3; 70 8,3.5; 72 8,4.5; 73 8,5; 74 8,5.5; 75 8,6 | smd 0.3 x 1.5: 26 -6,-8; 27 -5.5,-8; 28 -5,-8; 29 -4.5,-8; 30 -4,-8; 31 -3.5,-8; 32 -3,-8; 33 -2.5,-8; 34 -2,-8; 35 -1.5,-8; 36 -1,-8; 37 -0.5,-8; 38 0,-8; 39 0.5,-8; 40 1,-8; 41 1.5,-8; 42 2,-8; 43 2.5,-8; 44 3,-8; 45 3.5,-8; 46 4,-8; 47 4.5,-8; 48 5,-8; 49 5.5,-8; 50 6,-8; 76 6,8; 77 5.5,8; 78 5,8; 79 4.5,8; 80 4,8; 81 3.5,8; 82 3,8; 83 2.5,8; 84 2,8; 85 1.5,8; 86 1,8; 87 0.5,8; 88 0,8; 89 -0.5,8; 90 -1,8; 91 -1.5,8; 92 -2,8; 93 -2.5,8; 94 -3,8; 95 -3.5,8; 96 -4,8; 97 -4.5,8; 98 -5,8; 99 -5.5,8; 100 -6,8 | smd 1.5 x 0.35: 61 8,-1; 71 8,4
NX5032CA-8MHZ = smd 1.7 x 2: 1 0,0; 2 3.7,0
FCM1608KF-601T03 = smd 0.6 x 0.8: 1 -0.05,0.4; 2 1.65,0.4
32.768KHZ-FC-135 = smd 1.3 x 1.8: 1 0,0; 2 2.5,0
INA827 = smd 1.75 x 0.45: 1 -3,3; 2 -3,2.35; 3 -3,1.7; 4 -3,1.05; 5 1.4,1.05; 6 1.4,1.7; 7 1.4,2.35; 8 1.4,3
CAPSENSE_PAD = smd 12 x 6.1: P$1 0,3; P$2 0,-3
MAX30100 = smd 1.397 x 0.35: 1 -0.381,4.8; 2 -0.381,4; 3 -0.381,3.2; 4 -0.381,2.4; 5 -0.381,1.6; 6 -0.381,0.8; 7 -0.381,0; 8 2.531,0; 9 2.531,0.8; 10 2.531,1.6; 11 2.531,2.4; 12 2.531,3.2; 13 2.531,4; 14 2.531,4.8
ER-OLED0.96 = smd 0.4 x 4: P$1 0.85,2; P$2 1.55,2; P$3 2.25,2; P$4 2.95,2; P$5 3.65,2; P$6 4.35,2; P$7 5.05,2; P$8 5.75,2; P$9 6.45,2; P$10 7.15,2; P$11 7.85,2; P$12 8.55,2; P$13 9.25,2; P$14 9.95,2; P$15 10.65,2; P$16 11.35,2; P$17 12.05,2; P$18 12.75,2; P$19 13.45,2; P$20 14.15,2; P$21 14.85,2; P$22 15.55,2; P$23 16.25,2; P$24 16.95,2; P$25 17.65,2; P$26 18.35,2; P$27 19.05,2; P$28 19.75,2; P$29 20.45,2; P$30 21.15,2

### Placement (x,y rotation side)
C1  7.28,34.81 180 bottom
C2  7.89,39.01 90 bottom
C3  8.29,42.67 90 bottom
C4  9.98,29.22 180 bottom
C5  14.01,34.06 270 bottom
C6  23.87,3.72 0 bottom
C7  21.46,3.72 0 bottom
C8  19.15,3.77 0 bottom
C9  16.99,3.82 0 bottom
C10  14.93,3.77 0 bottom
C11  12.87,3.77 0 bottom
C12  10.76,3.77 0 bottom
C13  8.7,3.77 0 bottom
C14  63.64,24.42 0 top
C15  56.44,7.61 90 top
C16  37.16,8.99 270 top
C17  36.95,18.59 90 top
C18  37.18,21.49 90 top
C19  37.09,29.57 90 top
C20  26.9,36.51 0 top
C21  16.26,7.64 90 bottom
C22  10.6,13.99 180 bottom
C23  41.5,44.1 0 bottom
C24  40.35,37.2 0 bottom
C25  45.3,44.8 0 bottom
C26  50.9,38.1 180 bottom
C27  53.55,33.25 0 bottom
C28  61.6,31.45 0 bottom
C29  61.7,44.65 0 bottom
C30  62.05,40.4 0 bottom
C31  71.05,50.05 0 bottom
C32  75.25,50.3 0 bottom
C33  79.2,50.75 0 bottom
C34  27.5,48.55 0 bottom
C35  30.75,48.5 0 bottom
C36  20.9,48.55 0 bottom
C37  18.05,48.55 0 bottom
C38  14.75,48.35 0 bottom
D1  18.1,32.15 0 bottom
D2  42.15,2.91 90 top
IC1  13.74,29.23 0 bottom
IC2  14.67,41.61 0 bottom
IC3  16.68,15.64 0 bottom
JP1  33.45,3.35 180 top
JP2  54.9,2.95 0 top
JP3  28.85,9.1 0 top
JP4  28.35,23.15 0 top
R1  10.93,42.67 0 top
R2  79.32,41.67 0 top
R3  25.01,42.47 0 top
R4  45.89,3.01 0 top
R5  50.36,32.29 0 top
R6  55.95,32.34 0 top
R7  45.05,32.16 0 top
R8  69.5,23.25 180 bottom
R9  69.5,20.7 180 bottom
R10  69.5,18 180 bottom
R11  22.55,24.7 180 bottom
R12  22.5,22.1 180 bottom
R13  22.5,19.5 180 bottom
R14  28.4,13.15 0 top
R15  28.25,27.15 0 top
R16  41.5,48.6 180 bottom
R17  40.85,40.55 0 bottom
R18  45.5,40.9 0 bottom
R19  46.05,48.7 180 bottom
R20  51.1,48.1 0 bottom
R21  50.7,44.75 0 bottom
R22  50.5,41.3 0 bottom
R23  44.85,37.8 0 bottom
R24  58.3,29.35 0 bottom
R25  58.35,33.7 0 bottom
R26  56.2,36.95 0 bottom
R27  53.65,29.25 0 bottom
R28  66.3,29.1 0 bottom
R29  66.05,33.6 0 bottom
R30  66.65,40.1 0 bottom
R31  66.4,44.65 0 bottom
R32  56.05,44.65 0 bottom
R33  56.25,41.05 0 bottom
R34  57.45,50.45 0 bottom
R35  62.1,50.9 0 bottom
R36  65.95,51.25 0 bottom
R37  78.2,47.2 0 bottom
R38  24.1,48.5 90 bottom
R39  10.4,47.8 0 bottom
R40  10.35,50.65 0 bottom
R41  6,47.7 0 bottom
S1  34,36.26 0 top
U1  28.34,31.33 0 top
U2  2.21,26.76 0 top
U3  28.44,17.58 0 top
U4  45.41,39.8 270 top
U5  62.63,44.1 0 top
U$1  52.11,19.86 0 top
U$2  37.02,15.98 270 top
U$3  22.09,7.08 0 bottom
U$4  37.17,26.7 270 top
U$5  33.51,40.51 0 top
U$6  74.82,31.61 0 top
U$7  74.82,10.25 0 top
U$8  16.03,31.61 0 top
U$9  16.13,10.28 0 top
U$10  77.61,19.91 90 top
U$11  18.32,20.01 90 top
U$12  33.25,47.4 0 top

### Tracks (layer width: path | path; a pad name or v marks a point on that pad's centre or on a via)
1V8  (via drill 0.61)
  Top 0.254: v16.25,21.12 16,21.38 16,22.5 U$11.11 16,22.62 16,23.25 17.12,24.38 21.38,24.38 23,26 v23.25,26 | v73.5,24.75 75.12,23.12 75.12,22.5 U$10.11
  Bottom 0.254: C22.2 10.62,14.88 14.38,18.62 16.62,18.62 IC3.4 | v16.25,21.12 16.25,18.75 IC3.4 | v73.5,24.75 72.25,26 v23.25,26 | IC3.2 16.62,12.62 16.62,18.5 IC3.4
ADC1  (via drill 0.61)
  Top 0.254: U5.14 60.62,47.12 v59.62,47.12 59.62,41.75 57.88,40 v57.88,35.75 | v40.75,21 42.88,18.88 44,18.88 U$1.15 | v39,22.75 39,23 40.62,24.62 v40.62,26.88
  Bottom 0.254: C33.2 79.25,49.88 79.25,48.12 79.75,48.12 80,47.88 80,46.25 78.25,46.25 77.38,47.12 R37.2 77.25,47.12 v59.62,47.12 | v39,22.75 v40.75,21 | v40.62,26.88 49.5,35.75 v57.88,35.75
ADC2  (via drill 0.61)
  Top 0.254: v30.5,16.75 30.12,16.38 29.5,16.38 U3.3 | v30.5,18.5 29.88,18.5 29.5,18.88 U3.4 | v42.25,16.88 42.25,17.38 43.25,18.38 44,18.38 U$1.16
  Bottom 0.254: v30.5,18.5 v30.5,16.75 30.62,16.88 v42.25,16.88
ADC3  (via drill 0.61)
  Top 0.254: U1.4 29.38,32.62 29.38,30.12 U1.3 29.5,30.12 v35,24.62 | v47.25,21.75 47.25,19 46,17.75 45.25,17.75 45.12,17.88 44.12,17.88 U$1.17
  Bottom 0.254: v47.25,21.75 47.25,22.75 46.75,22.75 45.88,23.62 42,23.62 41.88,23.75 35.88,23.75 v35,24.62
GND  (via drill 0.6, 0.61)
  Top 0.254: 49.31,31.44 46.62,28.75 46.62,27.88 U$1.99 46.62,27.75 46.62,22.38 45.62,21.38 44.12,21.38 U$1.10 | 49.31,31.44 49.5,31.62 49.5,32.25 R5.1 | 49.31,31.44 v49.75,31 | v68.12,51.25 67.62,51.25 64.38,48 62.88,48 62.62,47.75 62.62,47.12 U5.11 62.62,47 62.62,46.38 61.56,45.31 | v60.62,44.62 60.88,44.62 61.56,45.31 | 67.12,23.62 73.88,23.62 74.38,23.12 74.38,22.5 U$10.12 74.5,22.38 74.5,21.75 75.12,21.12 75.12,19.62 U$10.4 | 67.12,23.62 64.88,23.62 | 64.88,23.62 63.75,23.62 C14.2 | v58.62,25.12 58.88,25.38 60,25.38 U$1.74 | v64.88,23.75 64.88,23.62 | 61.56,45.31 64.62,42.25 66.5,42.25 67.12,41.62 67.12,37 | 67.12,23.62 67.12,27.88 | 67.12,27.88 67.12,37 | v67,27.88 67.12,27.88 | C15.2 57.12,7.5 57.12,6.38 53.75,3 JP2.2 53.62,3 53.38,3 51.5,4.88 50.12,4.88 47.38,2.12 42.25,2.12 41.5,2.88 D2.C 41.38,3 41.38,5.5 39.81,7.06 | 46.62,13 46.62,11.88 U$1.27 | 46.62,13 46.62,14.75 45,16.38 44.12,16.38 U$1.20 | 39.12,7.75 38,8.88 C16.1 | 39.12,7.75 39.81,7.06 | 39.12,7.75 37.69,6.31 | 37.69,6.31 34.75,3.38 JP1.2 | 46.62,13 45.75,13 39.81,7.06 | U$11.4 15.88,19.75 15.88,20.25 15.12,21 15.12,22.5 U$11.12 15,22.62 15,23.25 13.12,25.12 9.25,25.12 9,25.38 v8.85,25.5 | 7.62,37.75 7.62,27.38 5.88,25.62 5.88,25.46 | 7.62,37.75 v7.62,41.25 7.62,42.38 10.25,45 21.25,45 | v7.5,37.75 7.62,37.75 | 48.38,49.38 48.75,49.38 U$12.P$22 | 48.38,49.38 48.12,49.38 U$12.P$21 | U$12.P$22 48.88,49.38 49.5,49.38 U$12.P$23 49.62,49.38 50.12,49.38 U$12.P$24 50.25,49.38 50.88,49.38 U$12.P$25 | U$12.P$29 53.62,49.5 53.62,52 52.62,53 51.88,53 48.38,49.5 48.38,49.38 | U$12.P$8 39,47.38 39.38,47 40,47 40.38,47.38 40.38,49.38 U$12.P$10 40.5,49.5 40.5,51.5 40.75,51.75 41.5,51.75 41.75,51.5 41.75,49.5 U$12.P$12 41.88,49.38 42.5,49.38 U$12.P$13 42.5,47.38 42.88,47 44.38,47 v44.5,46.62
  Top 0.254: U$12.P$15 44,49.38 44.5,49.38 U$12.P$16 | U$12.P$17 45.25,49.38 44.62,49.38 U$12.P$16 | v44.5,46.62 44.5,49.25 U$12.P$16 | v48.75,46.62 48.75,49.25 U$12.P$22 | C19.1 36.38,29.62 36.38,34.12 36.5,34.25 S1.4 | 47.38,39.75 46.38,39.75 41,34.38 36.62,34.38 S1.4 | 47.38,39.75 48.25,39.75 U4.11 48.38,39.75 49.12,39.75 49.5,39.38 v49.75,39.38 | 35,36.12 35,41.5 U$5.5 | 35,36.12 36.62,34.5 S1.4 | v44.5,46.62 44.88,46.62 47.38,44.12 47.38,39.75 | 28.31,15.69 28.38,15.75 28.38,16.25 U3.2 28.5,16.38 28.5,16.88 29.25,17.62 35.25,17.62 36.12,18.5 C17.1 36.25,18.62 36.25,21.25 36.38,21.38 C18.1 36.38,21.5 28.38,29.5 U1.2 | 28.31,15.69 27.62,15 27.62,13.25 R14.1 | R15.1 27.5,27.25 27.5,28.12 28.25,28.88 28.25,30 U1.2 | 28.38,35.62 30.12,35.62 31.38,34.38 S1.3 31.5,34.38 33.25,36.12 35,36.12 | 28.38,35.62 27,35.62 C20.2 26.88,35.88 21.25,41.5 | 21.81,45.69 21.25,45.12 21.25,45 | 21.81,45.69 v25.38,49.25 | 21.25,41.5 21.25,45 | v21.12,41.5 21.25,41.5 | 21.81,45.69 v19.25,48.25 | 28.38,35.62 28.38,30.12 U1.2 | 28.31,15.69 37.69,6.31 | v63.88,37 67.12,37
  Top 0.406: 7.33,25.46 5.88,25.46 U2.GND1 | v8.85,25.5 8.81,25.46 8,25.46 7.33,25.46 | U2.GND 2.77,26.2 2.77,24.18 3.73,23.22 5.09,23.22 7.33,25.46
  Bottom 0.254: 51.88,29.88 52.12,30.12 56.62,30.12 57.38,29.38 R24.2 | 51.88,29.88 51.88,27.5 65.62,27.5 66.44,28.31 | 66.44,28.31 67.12,29 R28.1 | v49.75,31 50.62,31 51.75,29.88 51.88,29.88 | C29.2 61.62,44 61,44.62 v60.62,44.62 57,44.62 R32.1 | v68.12,51.25 R36.1 | v58.62,25.12 60,23.75 v64.88,23.75 | 66.44,28.31 66.88,27.88 v67,27.88 | C13.1 8.75,4.62 10.75,4.62 C12.1 10.88,4.62 12.75,4.62 C11.1 13,4.5 14.88,4.5 C10.1 15,4.62 16.88,4.62 C9.1 17,4.62 19.12,4.62 C8.1 19.25,4.5 21.38,4.5 C7.1 21.5,4.5 23.75,4.5 C6.1 24,4.5 24.75,5.25 32.75,5.25 34.62,3.38 JP1.2 | 17.12,11 17.12,7.75 C21.1 | 17.12,11 17.38,11 18.88,12.5 IC3.1 | 17.12,11 15.62,11 15.62,13.5 15.12,14 11.38,14 10.62,13.25 C22.1 10.62,13.38 9,15 9,25.38 v8.85,25.5 | C5.1 13.12,34.12 7.38,34.12 C1.1 7.25,34 7.12,33.88 4,33.88 4,35.12 4.62,35.75 5.38,35.75 7.44,37.81 | 7.44,37.81 8.62,39 C2.1 | v7.62,41.25 9,42.62 C3.1 | IC1.2 13.62,28.12 13.62,29.12 10.75,29.12 10.12,28.5 C4.1 | v7.5,37.75 7.44,37.81 | 48.75,47.5 49.75,47.5 50.25,48 R20.2 | 48.75,47.5 44.5,47.5 v44.5,46.62 44.5,44.88 45.25,44.12 C25.2 | 48.75,47.5 v48.75,46.62 | 59.75,37 59.75,38.25 59.25,38.75 51,38.75 C26.2 50.88,38.88 50.38,39.38 v49.75,39.38 | 59.75,37 57.12,37 R26.1 | R39.2 10.88,49.12 14.62,49.12 C38.1 14.75,49.12 14.88,49.25 18,49.25 C37.1 18.12,49.25 19.12,48.25 v19.25,48.25 | v25.38,49.25 27.5,49.25 C34.1 | v21.12,41.5 19.88,41.5 17,38.62 IC2.1 | 59.75,37 v63.88,37
  Bottom 0.406: v8.85,25.5 8.85,27.33 C4.1
  pour Top: -0.55,55.85 86.15,55.85 86.15,-1.3 -0.55,-1.3
  pour Bottom: -0.1,55.85 86.15,55.85 86.15,-1.35 -0.55,-1.35 -0.55,55.85
I2C1_SCL  (via drill 0.61)
  Top 0.254: v68.88,19.38 69.5,19.38 70.5,18.38 73,18.38 73.5,18.88 73.5,19.5 U$10.2 | v50.75,29.38 50.12,28.75 50.12,27.88 U$1.92
  Bottom 0.254: v68.88,19.38 68.75,19.38 68.75,20.62 R9.1 68.75,20.75 69.88,21.88 76.5,21.88 76.5,24.25 74.25,26.5 50.75,26.5 v50.75,29.38
I2C1_SDA  (via drill 0.61)
  Top 0.254: v67.62,19.25 69,17.88 73.38,17.88 74.38,18.88 74.38,19.5 U$10.3 | v49.62,25.12 49.62,27.75 U$1.93
  Bottom 0.254: 67.31,21.94 67,21.62 67,19.25 v67.62,19.25 | 67.31,21.94 68.62,23.25 R8.1 | v49.62,25.12 52.75,22 67.25,22 67.31,21.94
I2C2_SCL  (via drill 0.61)
  Top 0.254: v13,21.12 13,18.75 13.25,18.5 13.75,18.5 14.25,19 14.25,19.62 U$11.2 | v48.12,22.62 48.12,21.38 56.62,12.88 56.62,11.88 U$1.47
  Bottom 0.254: 20.88,23.88 R11.1 | 20.88,23.88 15.75,23.88 v13,21.12 | v48.12,22.62 45.25,25.5 26.75,25.5 25,23.75 20.88,23.75 20.88,23.88
I2C2_SDA  (via drill 0.61)
  Top 0.254: v14.25,21.12 15,20.38 15,19.75 U$11.3 | v53,17.75 57.12,13.62 57.12,11.88 U$1.48
  Bottom 0.254: v14.25,21.12 15.12,22 21.62,22 R12.1 22.5,21.25 29,21.25 32.5,17.75 v53,17.75
I2C3_SCL  (via drill 0.61)
  Top 0.254: v44.88,52.5 46,51.38 U$12.P$18 | v61.62,16.25 61.62,21.25 61,21.88 60.12,21.88 U$1.67
  Bottom 0.254: v44.88,52.5 44.44,52.94 | 44.44,52.94 44,53.38 8.5,53.38 8.5,51 5.25,47.75 R41.2 | v61.62,16.25 62,16.62 73,16.62 80.75,24.38 80.75,53 44.5,53 44.44,52.94
I2C3_SDA  (via drill 0.61)
  Top 0.254: v18.62,50.88 19.12,50.88 21.75,53.5 45.12,53.5 46.62,52 46.62,49.5 U$12.P$19 46.75,49.38 47.38,49.38 U$12.P$20 47.5,49.38 47.5,47.25 47.88,46.88 47.88,44.25 58.62,33.5 58.62,26.38 57.75,25.5 57.75,22.75 59.12,21.38 60,21.38 U$1.66
  Bottom 0.254: v18.62,50.88 11.38,50.88 11.25,50.75 R40.1
INT_EXTI5  (via drill 0.61)
  Top 0.254: v70.88,19.25 73,21.38 73.12,21.38 73.5,21.75 73.5,22.38 U$10.13 | v56.38,21.12 50.62,26.88 50.62,27.75 U$1.91
  Bottom 0.254: v70.88,19.25 70,19.25 68.75,18 R10.1 68.62,18.12 59.38,18.12 v56.38,21.12
INT_EXTI12  (via drill 0.61)
  Top 0.254: v19.25,19.12 18.12,18 13,18 12.12,18.88 12.12,22.5 13.25,23.62 13.88,23.62 14.25,23.25 14.25,22.62 U$11.13 | v56.12,15.88 58.12,13.88 60,13.88 U$1.51
  Bottom 0.254: v19.25,19.12 21.25,19.12 21.62,19.5 R13.1 21.75,19.5 25.38,15.88 v56.12,15.88
L_ARM  (via drill 0.61)
  Top 0.254: U$9.P$2 16.25,7.38 16.25,13.25 U$9.P$1 16.12,13.38 v7.88,21.62 | R1.2 11,44 12.38,44 16,40.38 16,34.62 U$8.P$1 16.12,34.5 16.12,28.62 U$8.P$2 16,28.5 13.88,26.38 v7.88,26.38
  Bottom 0.254: v7.88,26.38 v7.88,21.62
MCU_3V3  (via drill 0.61)
  Top 0.254: v41.38,46.38 40.88,46.38 38.06,43.56 | 38.06,43.56 38,43.5 35,43.5 U$5.8 | 38.06,43.56 40.94,40.69 | 40.94,40.69 41.75,39.88 42.38,39.88 U4.4 | U$11.10 16.75,22.62 17.5,22.62 U$11.9 17.5,22.75 17.5,23.12 18.25,23.88 24.62,23.88 | v26.38,19.5 26.88,19.5 27.38,19 U3.5 | 25.44,20.56 26.38,19.62 v26.38,19.5 | 25.44,20.56 24.62,21.38 v24.62,22.12 24.62,23.88 | 24.62,23.88 24.62,24.75 | 24.62,24.75 24.62,28.75 27.38,31.5 27.38,32.62 U1.5 | v24.75,24.75 24.62,24.75 | 40.94,40.69 38,37.75 38,36.62 v36.88,35.5 | JP3.2 30,9 28.12,7.12 27.12,7.12 25.38,8.88 25.38,20.5 25.44,20.56 | 46.94,10.81 47.12,11 47.12,11.75 U$1.28 47.12,11.88 47.12,15 45.56,16.56 | 46.94,10.81 46.75,10.62 46.75,3.12 R4.2 | 45.56,16.56 45.25,16.88 44.12,16.88 U$1.19 | U$1.50 58.12,11.75 58.12,11 57.88,10.75 47,10.75 46.94,10.81 | R6.1 55,32.38 52.75,32.38 52,33.12 47.12,33.12 46.12,32.12 R7.2 46,32.12 46,27.88 U$1.100 46,27.75 46,24.38 45,23.38 | 45,23.38 44.12,23.38 U$1.6 | 61.75,27.5 61.75,38 62.62,38.88 62.62,41.12 U5.4 | U$1.75 61.75,27.5 | v75.62,23.88 75.62,23.62 76.44,22.81 | 76.44,22.81 76.75,22.5 U$10.9 | 76.44,22.81 76.12,22.5 U$10.10 76,22.38 v76,21 | v46.38,20.88 44.12,20.88 U$1.11 | 61.75,27.5 63.88,27.5 v66.25,25.12 | v45.62,22.62 45.62,22.88 45.12,23.38 45,23.38 | v48.12,19.12 45.56,16.56 | v26.38,19.5 26.88,19.62 26.88,20.5 29.5,23.12 JP4.2
  Bottom 0.254: C6.2 23.75,3 21.5,3 C7.2 21.38,3 19.25,3 C8.2 19.12,3 17,3 C9.2 16.88,3 16,2.12 8.12,2.12 7.38,2.88 7.38,7.75 14.38,7.75 | 14.38,7.75 14.38,12.5 IC3.3 | 14.38,7.75 15.38,7.75 C21.2 15.5,7.62 16.38,6.75 17.5,6.75 19,8.25 21.38,8.25 22.12,7.5 U$3.1 22.25,7.5 25.75,11 28.12,11 30,9.12 JP3.2 | R19.1 44.5,48 43.38,48 41.75,46.38 v41.38,46.38 | 22.38,29 19.25,32.12 D1.1 | 22.38,29 22.38,25.62 23.25,24.75 23.38,24.75 R11.2 23.5,24.75 v24.75,24.75 | v26.38,19.5 R13.2 | v24.62,22.12 23.38,22.12 R12.2 | v36.88,35.5 30.38,29 22.38,29 | 71.75,20.62 71.75,18.88 71.25,18.38 70.75,18.38 70.38,18 R10.2 70.25,18 69.38,17.12 57.88,17.12 54.12,20.88 48.12,20.88 | 71.75,20.62 70.38,20.62 R9.2 | v75.62,23.88 71,23.88 70.38,23.25 R8.2 70.25,23.25 69.38,24.12 67.25,24.12 v66.25,25.12 | v76,21 72.25,21 71.88,20.62 71.75,20.62 | v46.38,20.88 45.62,20.12 39.5,20.12 36.5,23.12 29.62,23.12 JP4.2 | v46.38,20.88 48.12,20.88 | v45.62,22.62 45.62,21 46.38,21 v46.38,20.88 | 48.12,20.88 v48.12,19.12
N$1
  Top 0.254: D2.A 43,3 45,3 R4.1
N$2
  Top 0.254: C15.1 55.75,7.62 55.75,7.88 58.62,10.75 58.62,12.75 58.38,13 57.88,13 57.62,12.75 57.62,11.88 U$1.49
N$3
  Top 0.254: C14.1 63.62,25.12 61.25,25.12 61,24.88 60.12,24.88 U$1.73
N$4
  Top 0.254: 51.12,31.5 51.12,31 49.12,29 49.12,27.88 U$1.94 | 51.12,31.5 51.12,32.25 R5.2 | 51.12,31.5 56,31.5 56.75,32.25 R6.2
N$5  (via drill 0.61)
  Top 0.254: C20.1 27,37.38 30.62,37.38 31.38,38.12 S1.1 31.5,38.12 v34.12,38.12 | v37.12,37 37.12,37.62 36.62,38.12 S1.2 | R7.1 44.12,32.25 v41.88,32.25 41.88,32.12 41.5,31.75 v41.5,22.88 | v42.62,21 42.62,19.88 43.12,19.38 44,19.38 U$1.14
  Bottom 0.254: v41.88,32.25 v37.12,37 35.25,37 v34.12,38.12 | v42.62,21 42.62,22.88 v41.5,22.88
N$6
  Bottom 0.254: C4.2 10,30 10.38,30.38 12.75,30.38 IC1.4
N$7
  Bottom 0.254: 16.69,32.44 15.12,34 14.88,34 C5.2 | 16.69,32.44 16.88,32.25 D1.2 | 16.69,32.44 14.75,30.5 IC1.5
N$8
  Top 0.254: R3.3 26,41.12 27.88,41.12 28.88,42.12 30.5,42.12 U$5.3
N$9
  Top 0.254: 29,26 29,25.12 27.12,23.25 JP4.1 | 29,26 29,27.12 R15.2 | U3.1 27.5,16.38 27.5,17.38 28.62,18.5 28.62,19.75 30.75,21.88 30.75,24.38 29.12,26 29,26
N$10  (via drill 0.61)
  Top 0.254: 29.25,12.25 29.25,10.75 27.62,9.12 JP3.1 | 29.25,12.25 R14.2 | v25.5,23 25.62,23.12 25.62,27 27.38,28.75 27.38,30 U1.1 | v20.38,23 20.38,18.62 24.88,14.12 24.88,8.62 26.88,6.62 30,6.62 31.25,7.88 31.25,10.38 29.38,12.25 29.25,12.25
  Bottom 0.254: v20.38,23 v25.5,23
N$11
  Top 0.254: R3.2 25.12,43.88 28.5,43.88 29.5,42.88 30.5,42.88 U$5.2
N$12  (via drill 0.61)
  Top 0.254: v42.75,43.38 42.75,42.12 42.5,41.88 U4.1 | v36.5,41.75 36.12,42.12 35,42.12 U$5.6
  Bottom 0.254: v42.75,43.38 41.5,43.38 C23.2 41.38,43.38 38.12,43.38 v36.5,41.75
N$13  (via drill 0.61)
  Top 0.254: v12.12,43 10.38,41.25 10.12,41.25 R1.1 | v22.75,43.25 24.25,44.75 29.38,44.75 30.5,43.62 U$5.1 30.62,43.5 31.5,43.5 31.75,43.25 31.75,43.12 34.12,40.75 v34.12,40 | v43.5,35.62 v46.75,38.88
  Bottom 0.254: v12.12,43 12.38,43.25 v22.75,43.25 | v46.75,38.88 47.25,38.88 49.62,41.25 R22.2 | v43.5,35.62 39.75,35.62 35.38,40 v34.12,40
N$14  (via drill 0.61)
  Top 0.254: v77.38,41.25 78.38,40.25 R2.1 | v29,41 29.5,41.5 30.5,41.5 U$5.4
  Bottom 0.254: 56,46.25 72.38,46.25 v77.38,41.25 | 56,46.25 54.25,46.25 54.25,44.62 53.25,43.62 51,43.62 49.88,44.75 R21.2 | v29,41 29,51 51.38,51 56,46.38 56,46.25
N$15  (via drill 0.61)
  Top 0.254: v43.62,44.25 43.62,41.62 43.12,41.12 42.5,41.12 U4.2
  Bottom 0.254: R16.2 41.25,47.5 35.5,47.5 35.12,47.12 35,47.12 35,46.25 35.62,45.62 40.75,45.62 41.5,44.88 C23.1 41.62,44.88 43,44.88 v43.62,44.25
N$16  (via drill 0.61)
  Top 0.254: v38.62,40.75 37.38,42 37.38,42.12 36.62,42.88 35,42.88 U$5.7 34.88,42.88 33.88,42.88 33.62,43.12 33.62,44 v34.5,44.88
  Bottom 0.254: v38.62,40.75 39.88,40.75 40,40.62 R17.2 | v34.5,44.88 34.5,47.38 35.12,48 40.12,48 40.62,48.5 R16.1
N$17  (via drill 0.61)
  Top 0.254: U4.6 41.75,38.5 v40.88,39.38
  Bottom 0.254: 40.75,39.62 39.5,39.62 39.5,37.25 40.25,36.5 C24.2 | 40.75,39.62 41.62,40.5 R17.1 41.75,40.62 44.38,40.62 R18.2 | v40.88,39.38 40.75,39.5 40.75,39.62
N$18  (via drill 0.61)
  Top 0.254: 43.25,40.38 43.5,40.12 43.5,39.5 43.25,39.25 42.5,39.25 U4.5 | 43.25,40.38 42.5,40.38 U4.3 | v51.38,42.75 51.38,43 v52.88,44.5 | v46.5,43.75 43.25,40.5 43.25,40.38
  Bottom 0.254: 46.5,45.62 50.62,45.62 51.5,44.75 R21.1 | 46.5,45.62 45.38,45.62 C25.1 | v51.38,42.75 51.38,41.38 R22.1 | v52.88,44.5 52.62,44.75 R21.1 | R21.1 52,44.88 52,48 R20.1 51.88,48.12 51,49 47.25,49 47,48.75 R19.2 | 46.5,45.62 v46.5,43.75
N$19  (via drill 0.61)
  Top 0.254: v42.25,36.88 42.38,37 42.38,37.75 U4.7
  Bottom 0.254: 43.38,37.88 44,37.88 R23.2 | 43.38,37.88 42.25,37.88 | 42.25,37.88 40.38,37.88 C24.1 | R18.1 46.25,40.88 43.38,38 43.38,37.88 | 42.25,37.88 v42.25,36.88
N$20  (via drill 0.61)
  Top 0.254: v52.5,36.62 v52.5,34.88
  Bottom 0.254: v52.5,34.88 52.75,34.88 53.5,34.12 C27.1 | v52.5,36.62 51.88,37.25 51,37.25 C26.1 50.88,37.38 46.12,37.38 R23.1
N$21  (via drill 0.61)
  Top 0.254: 60.38,37.88 60.38,39.62 61.25,40.5 61.25,41.12 U5.2 | 60.38,37.88 v60.38,36.12 | 60.38,37.88 v58.88,37.88
  Bottom 0.254: v60.38,36.12 63.88,36.12 63.88,30.88 61,28 54.12,28 52.88,29.25 R27.2 | v58.88,37.88 56.25,37.88 55.38,37 R26.2
N$22  (via drill 0.61)
  Top 0.254: U5.1 60.75,41.25 60.75,41.88 61,42.12 63,42.12 63.25,41.88 63.25,41.25 U5.5 63.25,41.12 63.25,38.75 63,38.5 v63,35.12
  Bottom 0.254: R27.1 55.25,28.5 60.75,28.5 62.38,30.12 62.38,34.62 | 62.38,34.62 58.38,34.62 57.5,33.75 R25.2 | v63,35.12 62.5,34.62 62.38,34.62
N$23  (via drill 0.61)
  Top 0.254: v60.5,31.5 61.25,32.25 61.25,38.25 61.88,38.88 61.88,41.12 U5.3
  Bottom 0.254: R24.1 59.25,29.38 60.25,29.38 61.5,30.62 C28.2 61.38,30.62 v60.5,31.5
N$24
  Bottom 0.254: C27.2 53.62,32.5 53.88,32.75 58.25,32.75 R25.1 59.25,33.62 60.12,33.62 61.5,32.25 C28.1
N$25  (via drill 0.61)
  Top 0.254: v64,38.25 64,41.12 U5.6
  Bottom 0.254: R28.2 65.38,29.12 65.38,33.5 65.25,33.5 R29.2 65.12,33.62 65.12,37.12 v64,38.25
N$26  (via drill 0.61)
  Top 0.254: v66.12,41.38 66,41.25 64.75,41.25 U5.7
  Bottom 0.254: R29.1 67,33.62 67,40 67.5,40 R30.1 67.38,40.12 v66.12,41.38
N$27
  Bottom 0.254: 62.94,40.31 63.12,40.12 65.75,40.12 R30.2 | 62.94,40.31 62.12,41.12 C30.1 | 62.94,40.31 67.25,44.62 R31.1
N$28  (via drill 0.61)
  Top 0.254: v63.25,44.88 63.25,47 U5.10
  Bottom 0.254: 63.25,44.75 65.5,44.75 R31.2 | 63.25,44.75 62.38,44.75 61.75,45.38 C29.1 | v63.25,44.88 63.25,44.75
N$29  (via drill 0.61)
  Top 0.254: 69.5,51 69.12,51 65.25,47.12 64.75,47.12 U5.8 | 69.5,51 v72.25,51 | 69.5,51 69.5,51.12 68.5,52.12 67.75,52.12 66.12,50.5 v59.88,50.5 59.88,50.38 58.75,49.25 v58.75,42.12
  Bottom 0.254: 58.75,40.12 56.38,40.12 55.5,41 R33.2 | 58.75,40.12 61.62,40.12 62,39.75 C30.2 | v72.25,51 75.25,51 C32.1 | v59.88,50.5 58.38,50.5 R34.1 | v58.75,42.12 58.75,40.12
N$30  (via drill 0.61)
  Top 0.254: v64.62,43.5 64.62,45.25 64,45.88 64,47 U5.9
  Bottom 0.254: 57,43 57,43.75 56.12,43.75 55.25,44.62 R32.2 | 57,43 57,41.12 R33.1 | v64.62,43.5 64.12,43 57,43
N$31
  Bottom 0.254: 63.69,51.69 63,51 R35.1 | 63.69,51.69 64.12,52.12 78.62,52.12 79.12,51.62 C33.1 | R34.2 56.62,50.5 57.88,51.75 63.62,51.75 63.69,51.69
N$32
  Bottom 0.254: C32.2 75.25,49.62 72.25,49.62 71.12,50.75 C31.1 71.38,50.38 66,50.38 65.12,51.25 R36.2
N$33  (via drill 0.61)
  Top 0.254: v42.12,52.5 43.12,51.5 43.12,49.5 U$12.P$14
  Bottom 0.254: C34.2 27.5,47.88 27,48.38 25,48.38 24.12,49.25 R38.2 27.25,52.5 v42.12,52.5
N$34  (via drill 0.61)
  Top 0.254: v62,49.5 62,47.12 U5.12
  Bottom 0.254: 62.25,49.88 70.5,49.88 71,49.38 C31.2 | 62.25,49.88 61.25,50.88 R35.2 | v62,49.5 62.25,49.75 62.25,49.88
N$35  (via drill 0.61)
  Top 0.254: v61.12,48.38 61.12,47.88 61.25,47.75 61.25,47.12 U5.13
  Bottom 0.254: R37.1 77.88,48.38 v61.12,48.38
N$38  (via drill 0.61)
  Top 0.254: v32.38,50.12 32.38,50.38 33.75,51.75 35.12,51.75 35.5,51.38 U$12.P$3
  Bottom 0.254: v32.38,50.12 31.5,50.12 30.75,49.38 C35.1
N$39  (via drill 0.61)
  Top 0.254: v33.12,45.88 v28.12,45.88 | v36.62,44.38 36.62,46.12 36.88,46.38 36.88,49.38 U$12.P$5
  Bottom 0.254: v28.12,45.88 26.25,45.88 26,46.12 20.12,46.12 20.12,48.5 20.88,49.25 C36.1 | v33.12,45.88 33.12,44 36.25,44 v36.62,44.38
N$40  (via drill 0.61)
  Top 0.254: v32.88,47.75 33.62,47 34.38,47 34.75,47.38 34.75,49.38 U$12.P$2
  Bottom 0.254: v32.88,47.75 C35.2
N$41  (via drill 0.61)
  Top 0.254: v26.62,46.75 27.75,46.75 33.25,52.25 35.38,52.25 36.12,51.5 36.12,49.5 U$12.P$4
  Bottom 0.254: v26.62,46.75 22,46.75 21,47.75 C36.2
N$42  (via drill 0.61)
  Top 0.254: v49.88,43.5 49.88,45.62 51.5,47.25 51.5,49.38 U$12.P$26
  Bottom 0.254: v49.88,43.5 48.88,42.5 39.12,42.5 37.5,40.88 33.75,40.88 29.88,37 13.62,37 13.62,39.5 12.88,40.25 6.75,40.25 6.75,43.25 11.25,47.75 R39.1
N$43  (via drill 0.61)
  Top 0.254: v52.88,46.62 52.38,47.12 52.38,49.38 U$12.P$27
  Bottom 0.254: v52.88,46.62 52.88,48.75 52,49.62 36,49.62 33.25,46.88 32.25,46.88 32.25,43 29.38,40.12 28.62,40.12 23.12,45.62 19.88,45.62 19.25,46.25 16,46.25 14.75,47.5 C38.2
N$44  (via drill 0.61)
  Top 0.254: v16.88,47.88 17.62,47.88 21.38,51.62 v27.75,51.62 | v52.25,52.12 53,51.38 U$12.P$28
  Bottom 0.254: v16.88,47.88 18,47.88 C37.2 | v27.75,51.62 51.75,51.62 v52.25,52.12
OSC32_IN  (via drill 0.61)
  Top 0.254: C19.2 37.75,29.5 37.75,27.25 37.25,26.75 U$4.1 37.25,26.62 v39.25,24.62 | v42.38,24.5 42.38,23.12 43.12,22.38 44,22.38 U$1.8
  Bottom 0.254: v42.38,24.5 42.25,24.62 v39.25,24.62
OSC32_OUT
  Top 0.254: U$4.2 37.25,24.12 37.88,23.5 37.88,21.5 C18.2 38,21.88 44,21.88 U$1.9
OSC_IN  (via drill 0.61)
  Top 0.254: U$2.1 37.12,16 37.62,16.5 37.62,18.5 C17.2 37.75,18.62 v38.75,19.62 | v46.38,19.62 45.62,20.38 44.12,20.38 U$1.12
  Bottom 0.254: v38.75,19.62 v46.38,19.62
OSC_OUT  (via drill 0.61)
  Top 0.254: C16.2 36.5,9 36.5,11.75 37,12.25 U$2.2 37.12,12.38 37.12,13 41.88,17.75 v41.88,18.62 | v45.62,18.62 45.5,18.75 45.5,19.38 45,19.88 44.12,19.88 U$1.13
  Bottom 0.254: v41.88,18.62 v45.62,18.62
R_ARM
  Top 0.254: U$7.P$2 74.88,7.25 74.88,13.25 U$7.P$1 74.88,13.38 74.88,15.38 78.12,18.62 78.12,25.25 74.88,28.5 U$6.P$2 74.88,28.62 74.88,34.5 U$6.P$1 74.88,34.62 74.88,40 77.88,43 79.25,43 R2.2
SWTCK  (via drill 0.61)
  Top 0.254: v57.25,16.5 57.25,25.75 58.12,26.62 58.12,27.75 U$1.76
  Bottom 0.254: v57.25,16.5 57.25,3 56.25,3 JP2.3
SWTDIO
  Top 0.254: U$1.72 60.12,24.38 61,24.38 62.5,22.88 62.5,6.75 58.75,3 JP2.4
UART2_RX  (via drill 0.61)
  Top 0.254: v41.25,7 U$1.26 | v34.5,5.62 32.25,3.38 JP1.3
  Bottom 0.254: v41.25,7 39.88,5.62 v34.5,5.62
UART2_TX  (via drill 0.61)
  Top 0.254: v40.38,13.75 44,13.75 U$1.25 | v32.5,6.12 29.75,3.38 JP1.4
  Bottom 0.254: v40.38,13.75 32.75,6.12 v32.5,6.12
VCC  (via drill 0.6, 0.61)
  Top 0.254: v6.12,30.38 4.91,30.38
  Top 0.406: U2.VBUS1 4.91,30.38 4.91,34.51 4.95,34.55 v4.95,34.8
  Bottom 0.254: IC2.3 12.25,38.5 9.5,35.75 7.38,35.75 C1.2 | JP2.1 51,3 37.62,3 37.38,3.25 JP1.1 37.25,3.25 35.38,1.38 6.12,1.38 v6.12,30.38
  Bottom 0.406: v4.95,34.8 5.25,34.8 6.1,35.65 7.2,35.65 C1.2
VDD  (via drill 0.61)
  Top 0.254: 37.62,51.5 37.62,49.5 U$12.P$6 37.62,49.38 37.62,47.38 38.5,46.5 40.25,46.5 41,47.25 41,49.38 U$12.P$11 | 37.62,51.5 37.88,51.75 39.38,51.75 39.62,51.5 39.62,49.5 U$12.P$9 | 30,52.75 25.88,52.75 v25.62,52.5 | 30,52.75 36.25,52.75 37.5,51.5 37.62,51.5 | v22.12,44.75 30,52.62 30,52.75
  Bottom 0.254: IC1.3 12.88,28 12.88,27.12 14.25,27.12 14.62,27.5 14.62,28 IC1.1 14.62,28.12 14.62,29.38 14.25,29.38 13.5,30.12 13.5,33.25 3.88,33.25 3.5,33.62 3.5,40 6.25,40 | 6.25,40 7.12,39.12 C2.2 | 6.25,40 6.25,47.62 6.75,47.62 R41.1 6.88,47.75 9.38,50.25 9.38,50.62 R40.2 9.5,50.75 10.5,51.75 20,51.75 22.44,49.31 | 9.31,44.44 9.5,44.62 14.62,44.62 IC2.4 14.75,44.75 v22.12,44.75 | 9.31,44.44 7.62,42.75 C3.2 | 9.31,44.44 11.62,42.12 14.62,42.12 14.62,38.62 IC2.2 | 22.44,49.31 R38.1 | 22.44,49.31 v25.62,52.5
VDDA  (via drill 0.61)
  Top 0.254: U$1.21 44.12,15.75 44.12,15.38 U$1.22 44,15.38 40.75,15.38 v38.75,13.38
  Bottom 0.254: C10.2 14.88,3 C11.2 12.75,3 10.88,3 C12.2 8.75,3 C13.2 8.62,3.12 7.88,3.12 7.88,5 8.25,5.38 18.38,5.38 19.69,6.69 | 19.69,6.69 20.38,7.38 U$3.2 | v38.75,13.38 32.38,7 22.88,7 22.5,6.62 19.75,6.62 19.69,6.69

### Text on the board
tPlace: NICBP V1 / TonyGUO / 2017/09/04